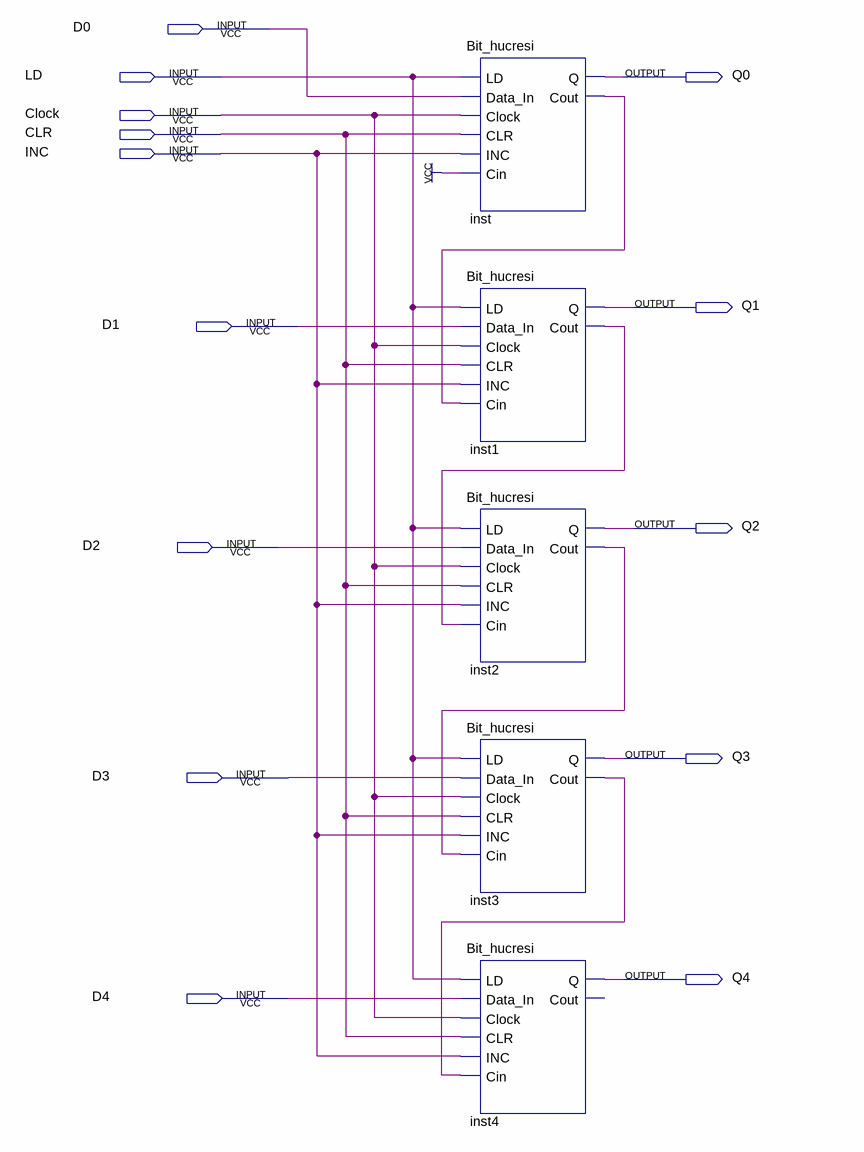
[diagram p0: schematic sheet]
// Quartus schematic Register_5bit.bdf as structural Verilog: 5 symbols, 14 pins
module Register_5bit (
  input  D0,
  input  LD,
  input  Clock,
  input  CLR,
  input  INC,
  input  D1,
  input  D2,
  input  D3,
  input  D4,
  output Q0,
  output Q1,
  output Q2,
  output Q3,
  output Q4
);

  wire inst1_cout, inst2_cout, inst3_cout, inst_cout;

  Bit_hucresi inst (.LD(LD), .Data_In(D0), .Clock(Clock), .CLR(CLR), .INC(INC), .Cin(1'b1), .Q(Q0), .Cout(inst_cout));
  Bit_hucresi inst1 (
    .LD(LD), .Data_In(D1), .Clock(Clock), .CLR(CLR), .INC(INC), .Cin(inst_cout), .Q(Q1), .Cout(inst1_cout));
  Bit_hucresi inst2 (
    .LD(LD), .Data_In(D2), .Clock(Clock), .CLR(CLR), .INC(INC), .Cin(inst1_cout), .Q(Q2), .Cout(inst2_cout));
  Bit_hucresi inst3 (
    .LD(LD), .Data_In(D3), .Clock(Clock), .CLR(CLR), .INC(INC), .Cin(inst2_cout), .Q(Q3), .Cout(inst3_cout));
  Bit_hucresi inst4 (
    .LD(LD), .Data_In(D4), .Clock(Clock), .CLR(CLR), .INC(INC), .Cin(inst3_cout), .Q(Q4));  // open: Cout
endmodule
